# Altium schematic sheet MODEM2.SchDoc
size A3; PageSetup: Record=PageOptions|CenterHorizontal=True|CenterVertical=True|PrintScale=0.70|XCorrection=1.00|YCorrection=1.00|PrintKind=2|BorderSize=5000000|LeftOffset=0|BottomOffset=0|Orientation=2|PaperLength=1000|PaperWidth=1000|Scale=100|PaperSource=7|PrintQuality=-3|MediaType=1|DitherType=10|PrintScaleMode=1|PaperKind=A4|PaperIndex=9
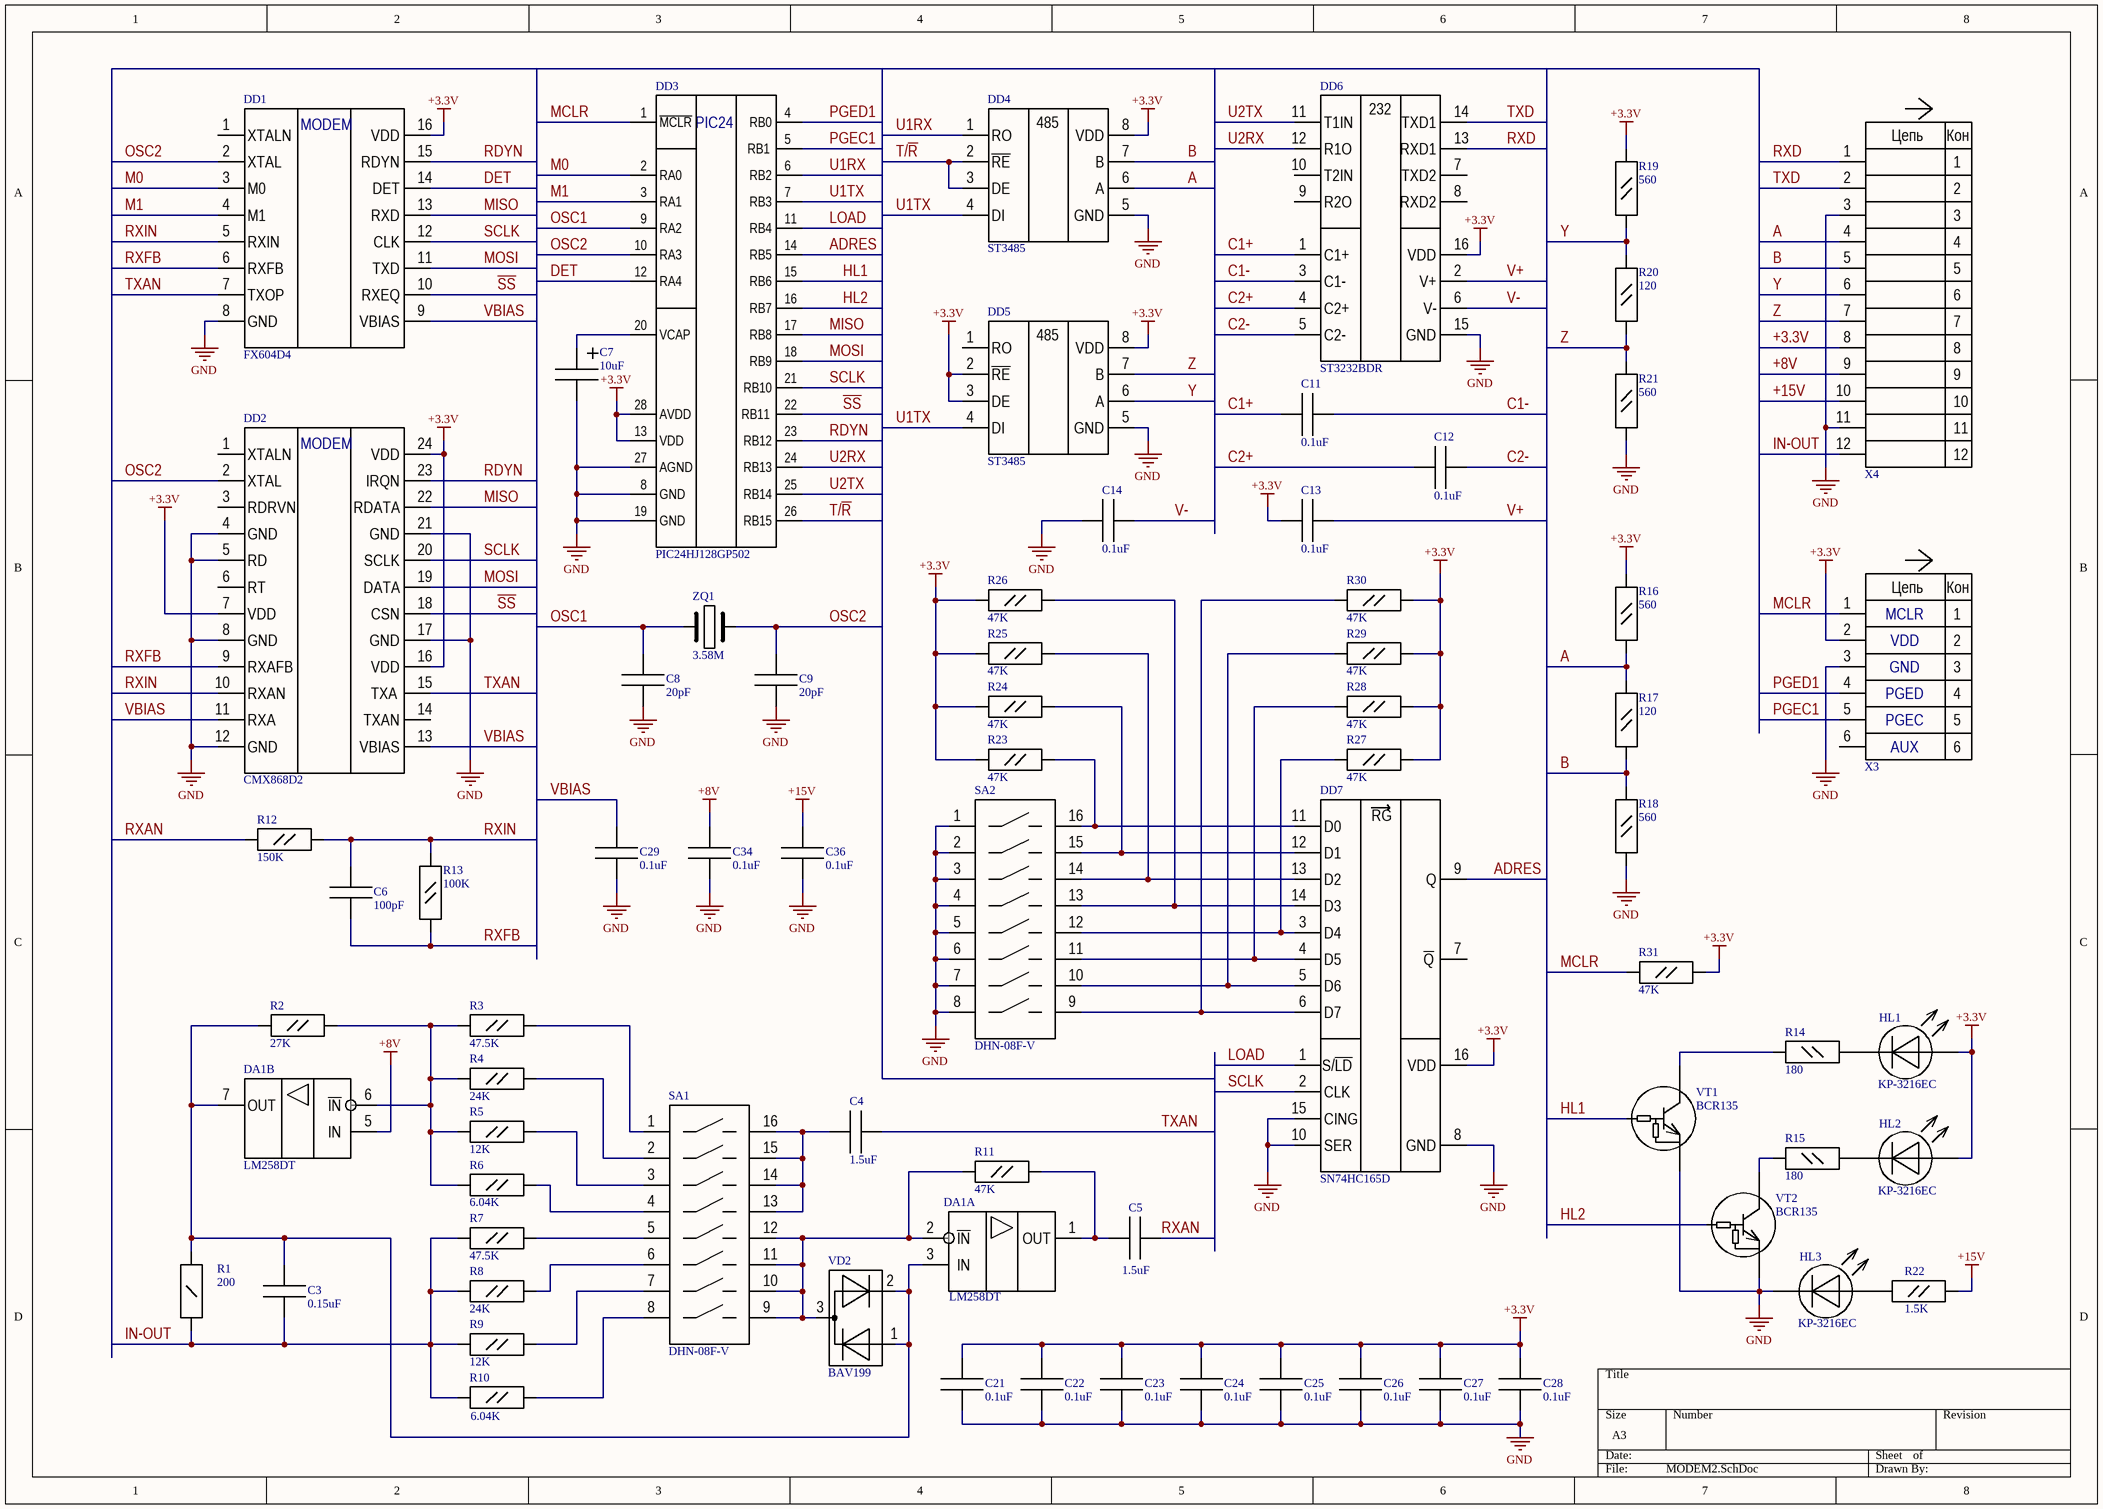
[diagram p0: MODEM2.SchDoc]

## Parts
C3  0.15uF  [CC0805]
C4  1.5uF  [CC1206]
C5  1.5uF  [CC1206]
C6  100pF  [CC0805]
C7  10uF  [SMB]
C8  20pF  [CC0805]
C9  20pF  [CC0805]
C11  0.1uF  [CC0805]
C12  0.1uF  [CC0805]
C13  0.1uF  [CC0805]
C14  0.1uF  [CC0805]
C21  0.1uF  [CC0805]
C22  0.1uF  [CC0805]
C23  0.1uF  [CC0805]
C24  0.1uF  [CC0805]
C25  0.1uF  [CC0805]
C26  0.1uF  [CC0805]
C27  0.1uF  [CC0805]
C28  0.1uF  [CC0805]
C29  0.1uF  [CC0805]
C34  0.1uF  [CC0805]
C36  0.1uF  [CC0805]
DA1  LM258DT  [LM258DT]  (parts A,B of 2)
DD1  FX604D4  [FX604D4]
DD2  CMX868D2  [CMX868D2]
DD3  PIC24HJ128GP502  [PIC24HJ128GP502]
DD4  ST3485  [SP3485]
DD5  ST3485  [SP3485]
DD6  ST3232BDR  [ST3232BDR]
DD7  SN74HC165D  [SN74HC165D]
HL1  KP-3216EC  [KP-3216EC]
HL2  KP-3216EC  [KP-3216EC]
HL3  KP-3216EC  [KP-3216EC]
R1  200  [RC1206]
R2  27K  [RC0805]
R3  47.5K  [RC0805]
R4  24K  [RC0805]
R5  12K  [RC0805]
R6  6.04K  [RC0805]
R7  47.5K  [RC0805]
R8  24K  [RC0805]
R9  12K  [RC0805]
R10  6.04K  [RC0805]
R11  47K  [RC0805]
R12  150K  [RC0805]
R13  100K  [RC0805]
R14  180  [RC0805]
R15  180  [RC0805]
R16  560  [RC0805]
R17  120  [RC0805]
R18  560  [RC0805]
R19  560  [RC0805]
R20  120  [RC0805]
R21  560  [RC0805]
R22  1.5K  [RC1206]
R23  47K  [RC0805]
R24  47K  [RC0805]
R25  47K  [RC0805]
R26  47K  [RC0805]
R27  47K  [RC0805]
R28  47K  [RC0805]
R29  47K  [RC0805]
R30  47K  [RC0805]
R31  47K  [RC0805]
SA1  DHN-08F-V  [DHN-08F-V]
SA2  DHN-08F-V  [DHN-08F-V]
VD2  BAV199  [BAV199]
VT1  BCR135  [BCR135]
VT2  BCR135  [BCR135]
X3  PLS-06  [PLS-06]  (value not drawn)
X4  PLS-12  [PLS-12]  (value not drawn)
ZQ1  3.58M  [HC-49/S]

## Nets
+3.3V: C13.1 C21.2 C22.2 C23.2 C24.2 C25.2 C26.2 C27.2 C28.2 DD1.16(VDD) DD2.7(VDD) DD2.16(VDD) DD2.24(VDD) DD3.13(VDD) DD3.28(AVDD) DD4.8(VDD) DD5.2(~{RE}) DD5.3(DE) DD5.8(VDD) DD6.16(VDD) DD7.16(VDD) HL1.1(A) HL2.1(A) R16.1 R19.1 R23.1 R24.1 R25.1 R26.1 R27.2 R28.2 R29.2 R30.2 R31.2 X3.2 X4.8
+8V: C34.2 DA1.5(IN) X4.9
+15V: C36.2 DA1.8(VDD) R22.2 X4.10
GND: C7.1(C) C8.1 C9.1 C14.1 C21.1 C22.1 C23.1 C24.1 C25.1 C26.1 C27.1 C28.1 C29.1 C34.1 C36.1 DA1.4(VSS) DD1.8(GND) DD2.4(GND) DD2.5(RD) DD2.8(GND) DD2.12(GND) DD2.17(GND) DD2.21(GND) DD3.8(GND) DD3.19(GND) DD3.27(AGND) DD4.5(GND) DD5.5(GND) DD6.15(GND) DD7.8(GND) DD7.10(SER) DD7.15(CING) HL3.2(С) R18.2 R21.2 SA2.1 SA2.2 SA2.3 SA2.4 SA2.5 SA2.6 SA2.7 SA2.8 VT1.2(E) VT2.2(E) X3.3 X4.3 X4.11
~{SS}: DD1.10(RXEQ) DD2.18(CSN) DD3.22(RB11)
A: DD4.6(A) R16.2 R17.1 X4.4
ADRES: DD3.14(RB5) DD7.9(Q)
B: DD4.7(B) R17.2 R18.1 X4.5
C1+: C11.1 DD6.1(C1+)
C1-: C11.2 DD6.3(C1-)
C2+: C12.1 DD6.4(C2+)
C2-: C12.2 DD6.5(C2-)
DET: DD1.14(DET) DD3.12(RA4)
HL1: DD3.15(RB6) VT1.1(B)
HL2: DD3.16(RB7) VT2.1(B)
IN-OUT: C3.1 R1.2 R7.1 R8.1 R9.1 R10.1 X4.12
LOAD: DD3.11(RB4) DD7.1(S/~{LD})
M0: DD1.3(M0) DD3.2(RA0)
M1: DD1.4(M1) DD3.3(RA1)
MCLR: DD3.1(~{MCLR}) R31.1 X3.1
MISO: DD1.13(RXD) DD2.22(RDATA) DD3.17(RB8)
MOSI: DD1.11(TXD) DD2.19(DATA) DD3.18(RB9)
OSC1: C8.2 DD3.9(RA2) ZQ1.1
OSC2: C9.2 DD1.2(XTAL) DD2.2(XTAL) DD3.10(RA3) ZQ1.2
PGEC1: DD3.5(RB1) X3.5
PGED1: DD3.4(RB0) X3.4
RDYN: DD1.15(RDYN) DD2.23(IRQN) DD3.23(RB12)
RXAN: C5.2 R12.1
RXD: DD6.13(RXD1) X4.1
RXFB: C6.2 DD1.6(RXFB) DD2.9(RXAFB) R13.2
RXIN: C6.1 DD1.5(RXIN) DD2.10(RXAN) R12.2 R13.1
SCLK: DD1.12(CLK) DD2.20(SCLK) DD3.21(RB10) DD7.2(CLK)
T/~{R}: DD3.26(RB15) DD4.2(~{RE}) DD4.3(DE)
TXAN: C4.2 DD1.7(TXOP) DD2.15(TXA)
TXD: DD6.14(TXD1) X4.2
U1RX: DD3.6(RB2) DD4.1(RO)
U1TX: DD3.7(RB3) DD4.4(DI) DD5.4(DI)
U2RX: DD3.24(RB13) DD6.12(R1O)
U2TX: DD3.25(RB14) DD6.11(T1IN)
V+: C13.2 DD6.2(V+)
V-: C14.2 DD6.6(V-)
VBIAS: C29.2 DD1.9(VBIAS) DD2.11(RXA) DD2.13(VBIAS)
Y: DD5.6(A) R19.2 R20.1 X4.6
Z: DD5.7(B) R20.2 R21.1 X4.7
NetC3_2: C3.2 DA1.3(IN) DA1.7(OUT) R1.1 R2.1 VD2.1(A) VD2.2(С)
NetC4_1: C4.1 SA1.13 SA1.14 SA1.15 SA1.16
NetC5_1: C5.1 DA1.1(OUT) R11.2
NetC7_2: C7.2(A) DD3.20(VCAP)
NetDA1_2: DA1.2(~{IN}) R11.1 SA1.9 SA1.10 SA1.11 SA1.12 VD2.3(AC)
NetDA1_6: DA1.6(~{IN}) R2.2 R3.1 R4.1 R5.1 R6.1
NetDD7_3: DD7.3(D4) R27.1 SA2.12
NetDD7_4: DD7.4(D5) R28.1 SA2.11
NetDD7_5: DD7.5(D6) R29.1 SA2.10
NetDD7_6: DD7.6(D7) R30.1 SA2.9
NetDD7_11: DD7.11(D0) R23.2 SA2.16
NetDD7_12: DD7.12(D1) R24.2 SA2.15
NetDD7_13: DD7.13(D2) R25.2 SA2.14
NetDD7_14: DD7.14(D3) R26.2 SA2.13
NetHL1_2: HL1.2(С) R14.2
NetHL2_2: HL2.2(С) R15.2
NetHL3_1: HL3.1(A) R22.1
NetR3_2: R3.2 SA1.1
NetR4_2: R4.2 SA1.2
NetR5_2: R5.2 SA1.3
NetR6_2: R6.2 SA1.4
NetR7_2: R7.2 SA1.5
NetR8_2: R8.2 SA1.6
NetR9_2: R9.2 SA1.7
NetR10_2: R10.2 SA1.8
NetR14_1: R14.1 VT1.3(C)
NetR15_1: R15.1 VT2.3(C)

Not connected (* = marked no-connect by the designer): DD1 1(XTALN); DD2 1(XTALN) 3(RDRVN) 6(RT) 14(TXAN); DD5 1(RO); DD6 7(TXD2) 8(RXD2) 9(R2O) 10(T2IN); DD7 7(~{Q}); X3 6

## Notes on the sheet
- (near X3) MCLR
- (near X3) VDD
- (near X3) GND
- (near X3) PGED
- (near X3) PGEC
- (near X3) AUX
- (in symbol CMX868D2) MODEM
- (in symbol FX604D4) MODEM
- (in symbol PIC24HJ128GP502) PIC24
- (in symbol PLS-06) Цепь; Кон
- (in symbol PLS-12) Цепь; Кон
- (in symbol SN74HC165D) RG
- (in symbol SP3232) 232
- (in symbol SP3485) 485

## Library data of the parts
C3-C6 C8 C9 C11-C14 C21-C29 C34 C36 = CC1206
C7 = SR-6
DD4 DD5 = SP3485
DD6 = SP3232
HL1-HL3 = KP-3216EC_L
R1 = RC1206
R2-R31 = RC0805
ZQ1 = ZQ